# EAGLE design esp-dimmer (EAGLE 9.6.2)
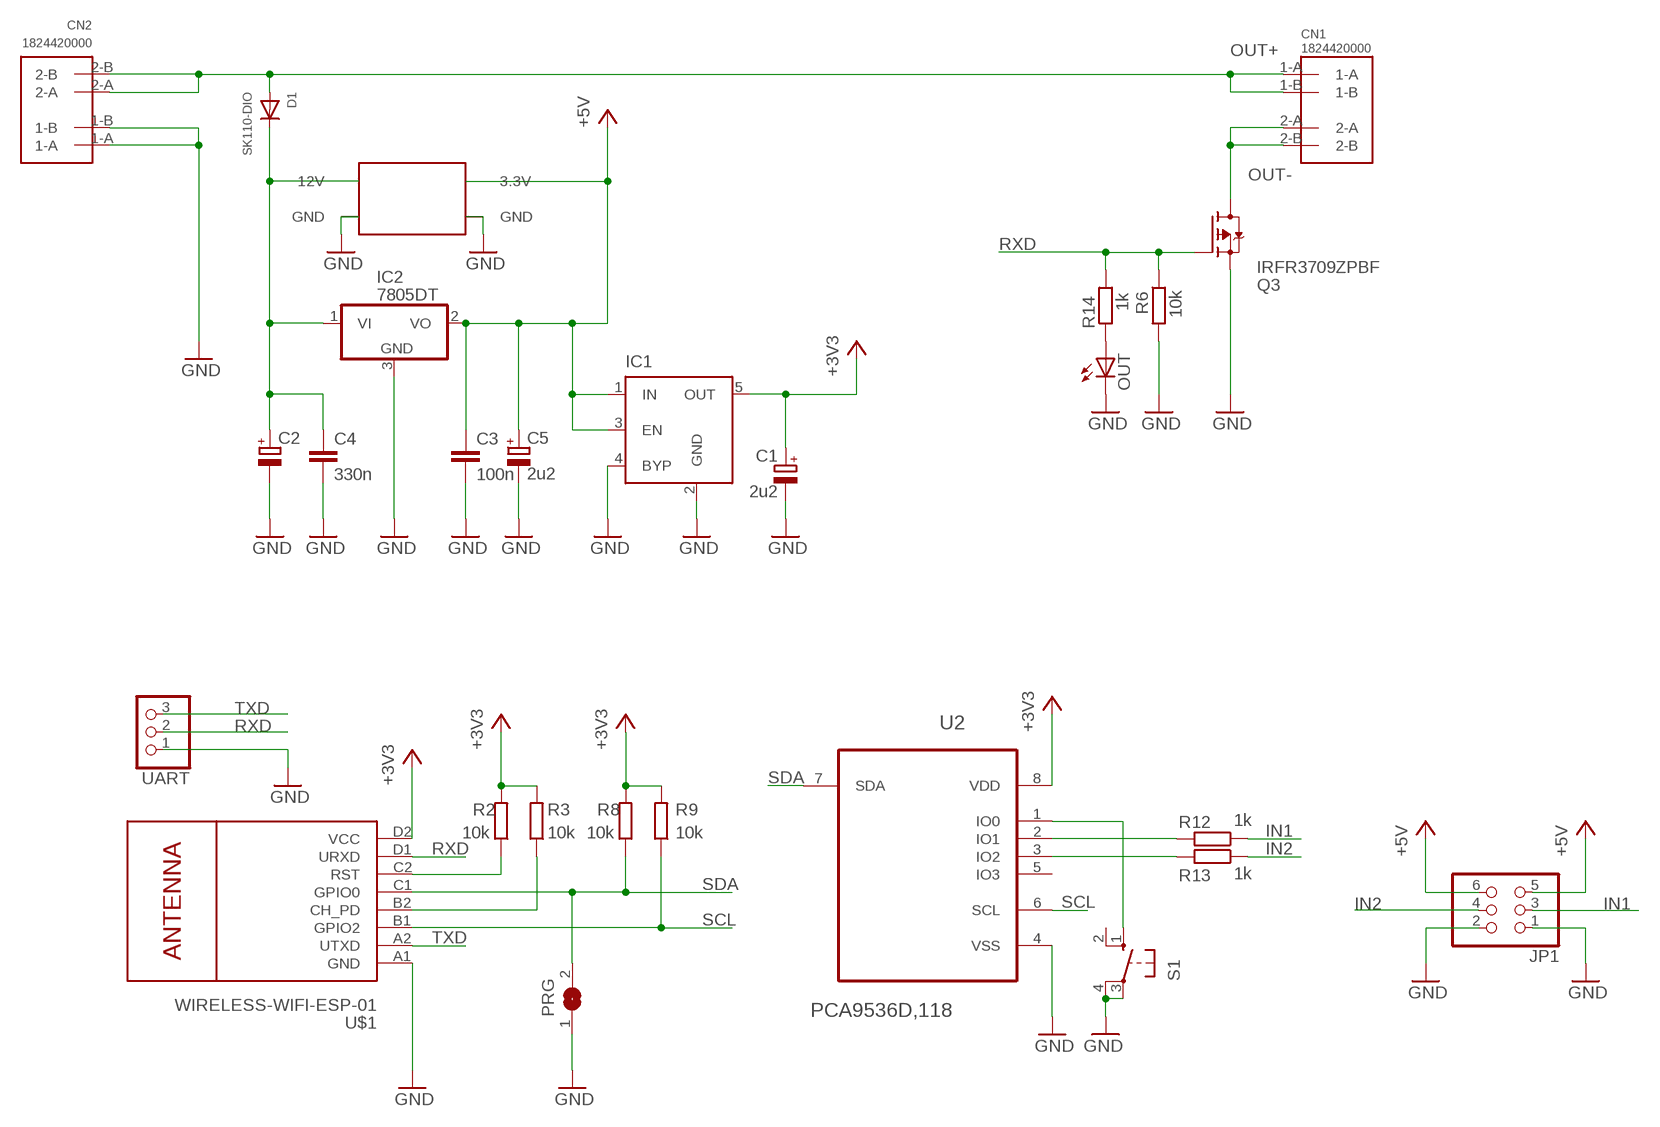
[diagram p0: schematic, sheet 1]

## Parts
C1  2u2  CPOL-EUSMCB  [SMC_B]
C2  CPOL-EUC/6032-28R  [C/6032-28R]
C3  100n  C-EUC0805  [C0805]
C4  330n  C-EUC0805  [C0805]
C5  2u2  CPOL-EUSMCB  [SMC_B]
CN1  1824420000  [1824420000]
CN2  1824420000  [1824420000]
D1  SK110-DIO  DIODESMA  [SMADIODE]
IC1  MIC5219XX  [SOT23-5]
IC2  7805DT  [TO252]
JP1  PINHD-2X3  [2X03]
OUT  LEDCHIPLED_0805  [CHIPLED_0805]
PRG  SJ  [SJ]
Q3  IRFR3709ZPBF  SPD30P06PTO252  [TO252]
R2  10k  R-EU_R0805  [R0805]
R3  10k  R-EU_R0805  [R0805]
R6  10k  R-EU_R0805  [R0805]
R8  10k  R-EU_R0805  [R0805]
R9  10k  R-EU_R0805  [R0805]
R12  1k  R-EU_R0805  [R0805]
R13  1k  R-EU_R0805  [R0805]
R14  1k  R-EU_R0805  [R0805]
S1  10-XX  [B3F-10XX]
U2  PCA9536D,118  [SOIC127P600X175-8N]
U$1  WIRELESS-WIFI-ESP-01  [WIRELESS-WIFI-ESP-01]
U$2  MP2307-MINI-360  [MP2307-MINI-360]
UART  PINHD-1X3  [1X03]

## Nets
+3V3: C1.+ IC1.5(OUT) R2.2 R3.2 R8.2 R9.2 U2.8(VDD) U$1.D2(VCC)
+5V: C3.1 C5.+ IC1.1(IN) IC1.3(EN) IC2.2(VO) JP1.5 JP1.6 U$2.3.3V
GND: C1.- C2.- C3.2 C4.2 C5.- CN2.1-A CN2.1-B IC1.2(GND) IC1.4(BYP) IC2.3(GND) JP1.1 JP1.2 OUT.C PRG.1 Q3.2(S) R6.2 S1.3(P) S1.4(P1) U2.4(VSS) U$1.A1(GND) U$2.GND@1(GND) U$2.GND@2(GND) UART.1
IN1: JP1.3 R12.1
IN2: JP1.4 R13.1
N$1: R3.1 U$1.B2(CH_PD)
N$2: R2.1 U$1.C2(RST)
N$3: S1.1(S) U2.1(IO0)
N$5: R13.2 U2.3(IO2)
N$6: R12.2 U2.2(IO1)
N$9: C2.+ C4.1 D1.C IC2.1(VI) U$2.12V
N$15: OUT.A R14.1
OUT+: CN1.1-A CN1.1-B CN2.2-A CN2.2-B D1.A
OUT-: CN1.2-A CN1.2-B Q3.3(D)
RXD: Q3.1(G) R6.1 R14.2 U$1.D1(URXD) UART.2
SCL: R9.1 U2.6(SCL) U$1.B1(GPIO2)
SDA: PRG.2 R8.1 U2.7(SDA) U$1.C1(GPIO0)
TXD: U$1.A2(UTXD) UART.3
Unconnected: S1.2(S1) U2.5(IO3)

## Library data of the parts
C1 C2 C5 = rcl:CPOL-EU: POLARIZED CAPACITOR, European symbol; SPICEPREFIX: C
C3 C4 = rcl:C-EU: CAPACITOR, European symbol; SPICEPREFIX: C
CN1 CN2 = 1824420000:1824420000: Check availability <https://pricing.snapeda.com/parts/1824420000/Weidmuller/view-part?ref=eda>; AVAILABILITY: In Stock; CHECK_PRICES: https://www.snapeda.com/parts/1824420000/Weidmuller/view-part/?ref=eda; DESCRIPTION: 2 Position Wire to Board Terminal Block Horizontal with Board 0.138 (3.50mm) Through Hole; MF: Weidmuller; MP: 1824420000; PACKAGE: None; PRICE: None; SNAPEDA_LINK: https://www.snapeda.com/parts/1824420000/Weidmuller/view-part/?ref=snap
D1 = adafruit:DIODE: Diode SMADIODE - SMA Surface Mount Package 20V 1A Schottky Diode Digikey: 641-1014-6-ND DO-1N4148 - Through Hole Small Current Diode SOD-123 20V 1 A (.5mV Vf) Schottky Diode - Digikey: MBRX120TPMSCT-ND SOD-323 10V 570mA (.38mV Vf, 3ns) Schottky Diode - Digikey: ZLLS410CT-ND SOD-523 30V 30mA Schottky Diode (RB751S-40TE61) - Digikey: RB751S-40TE61CT-ND SOT23-R/W - SOT23 Package (R = Solder Paste/Reflow Ovens, W = Hand-Soldering) BAT54Film 40V 300mA - Digikey: 497-7162-1-ND
IC1 = v-reg-micrel:MIC5219XX: VOLTAGE REGULATOR; OC_FARNELL: unknown; OC_NEWARK: unknown
IC2 = linear:78*: Positive VOLTAGE REGULATOR Source: http://cache.national.com/ds/LM/LM78L05.pdf http://www.fairchildsemi.com/ds/LM/LM7805.pdf
JP1 = pinhead:PINHD-2X3: PIN HEADER
OUT = adafruit:LED: LED OSRAM: - CHIPLED LG R971, LG N971, LY N971, LG Q971, LY Q971, LO R971, LY R971 LH N974, LH R974 LS Q976, LO Q976, LY Q976 LO Q996 - Hyper CHIPLED LW Q18S LB Q993, LB Q99A, LB R99A - SideLED LS A670, LO A670, LY A670, LG A670, LP A670 LB A673, LV A673, LT A673, LW A673 LH A674 LY A675 LS A676, LA A676, LO A676, LY A676, LW A676 LS A679, LY A679, LG A679 - Hyper Micro SIDELED® LS Y876, LA Y876, LO Y876, LY Y876 LT Y87S - SmartLED LW L88C, LW L88S LB L89C, LB L89S, LG L890 LS L89K, LO L89K, LY L89K LS L896, LA L896, LO L896, LY L896 - TOPLED LS T670, LO T670, LY T670, LG T670, LP T670 LSG T670, LSP T670, LSY T670, LOP T670, LYG T670 LG T671, LOG T671, LSG T671 LB T673, LV T673, LT T673, LW T673 LH T674 LS T676, LA T676, LO T676, LY T676, LB T676, LH T676, LSB T676, LW T676 LB T67C, LV T67C, LT T67C, LS T67K, LO T67K, LY T67K, LW E67C LS E67B, LA E67B, LO E67B, LY E67B, LB E67C, LV E67C, LT E67C LW T67C LS T679, LY T679, LG T679 LS T770, LO T770, LY T770, LG T770, LP T770 LB T773, LV T773, LT T773, LW T773 LH T774 LS E675, LA E675, LY E675, LS T675 LS T776, LA T776, LO T776, LY T776, LB T776 LHGB T686 LT T68C, LB T68C - Hyper Mini TOPLED® LB M676 - Mini TOPLED Santana® LG M470 LS M47K, LO M47K, LY M47K Source: http://www.osram.convergy.de/
PRG = jumper:SJ: SMD solder JUMPER
Q3 = transistor-fet:SPD30P06P: SIPMOS(R) Power-Transistor P-Channel, Enhancement mode Source: http://www.infineon.com/upload/Document/cmc_upload/documents/012/3615/SPD_U30P06P.pdf
R2 R3 R6 R8 R9 R12-R14 = rcl:R-EU_: RESISTOR, European symbol; SPICEPREFIX: R
S1 = switch-omron:10-XX: OMRON SWITCH; MPN: B3F-1000; OC_FARNELL: 176432; OC_NEWARK: 36M3542
U2 = PCA9536D_118:PCA9536D,118: 4-bit I2C-bus and SMBus I/O port Check availability <https://pricing.snapeda.com/parts/PCA9536D%2C118/NXP%20USA/view-part?ref=eda>; AVAILABILITY: In Stock; CHECK_PRICES: https://www.snapeda.com/parts/PCA9536D,118/NXP+USA+Inc./view-part/?ref=eda; DESCRIPTION: I/O Expander 4 I2C, SMBus 400 kHz 8-SO; MF: NXP USA; MP: PCA9536D,118; PACKAGE: SO-8 NXP Semiconductors; PRICE: None; PURCHASE-URL: https://www.snapeda.com/api/url_track_click_mouser/?unipart_id=556754&manufacturer=NXP USA&part_name=PCA9536D,118&search_term=None; SNAPEDA_LINK: https://www.snapeda.com/parts/PCA9536D,118/NXP+USA+Inc./view-part/?ref=snap
U$1 = diy-modules:WIRELESS-WIFI-ESP-01: Wireless Wi-Fi ESP-01 Module based on ESP8266 chip Click here to find device on ebay.com <http://www.ebay.com/sch/esp8266+esp+01+transceiver>
U$2 = MP2307-MINI-360:MP2307-MINI-360
UART = adafruit:PINHD-1X3: PIN HEADER

## Board
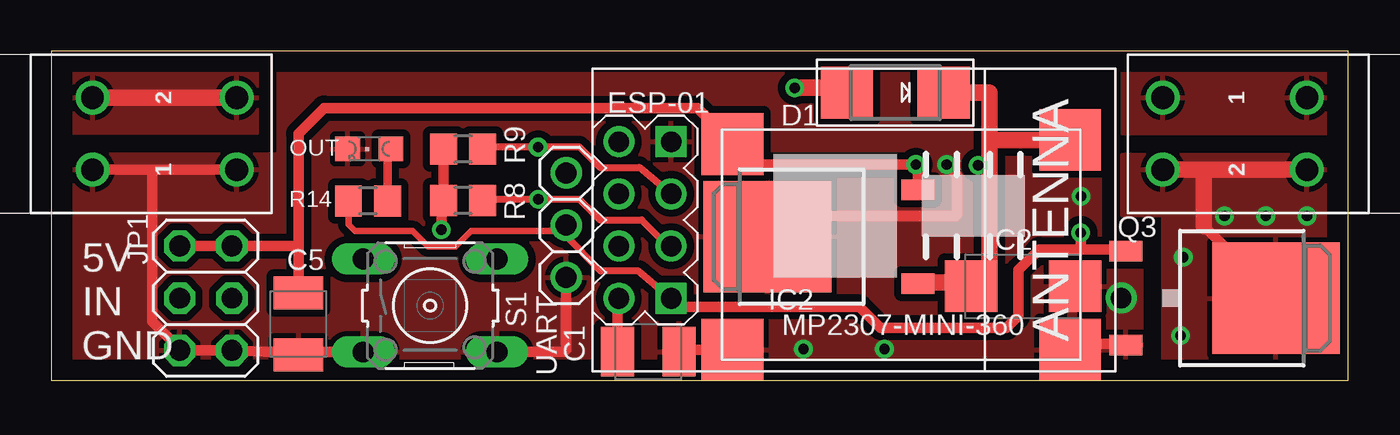
[diagram p1: board, top side]
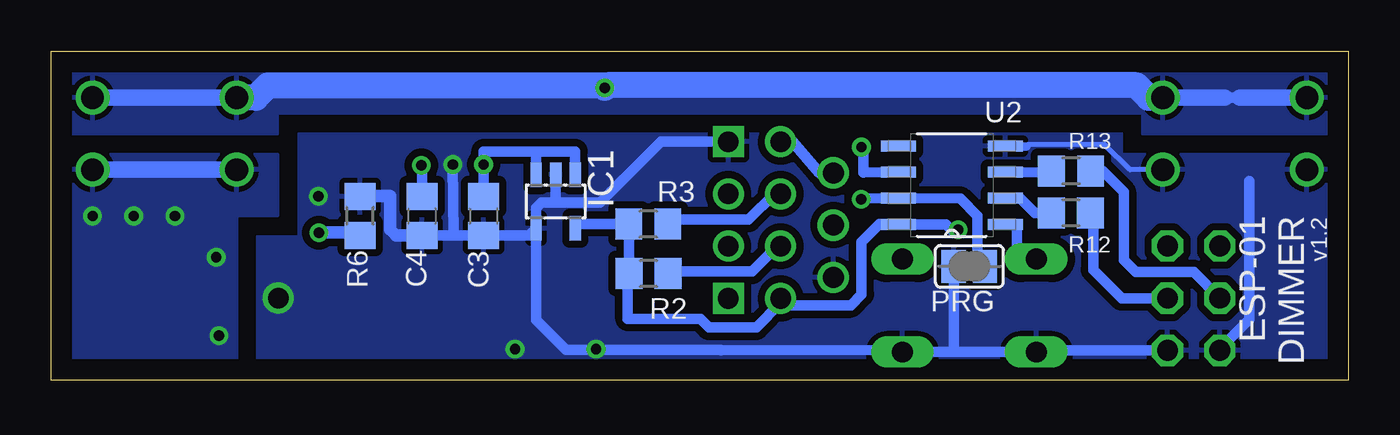
[diagram p2: board, bottom side, seen from below]

Size 63 x 16 mm. Coordinates in mm from the lower left corner, seen from the top.
Outline: 0,0 63,0 63,16 0,16 0,0
Copper layers (1*16): Top 0.035mm / dielectric 1.5mm / Bottom 0.035mm
Design rules "default *": minimum track width 6mil, minimum drill 0.35mm, track to track 14mil, track to pad 8mil, pad to pad 8mil, via to via 8mil, smd to smd 8mil, copper to edge 40mil, drill to drill 6mil, minimum pad ring 10mil, minimum via ring 8mil, stop-mask expansion 4mil, vias tented up to drill 0mil, thermal gap 10mil

### Footprints (pad centres in the part's own frame; a part is rotated, then mirrored left to right if it is on the bottom)
SMC_B = smd 1.6 x 2.4: + -1.5,0; - 1.5,0
C/6032-28R = smd 2.55 x 2.5: + 2.525,0; - -2.525,0
C0805 = smd 1.3 x 1.5: 1 -0.95,0; 2 0.95,0
1824420000 = drill 1.1: 1-A 1.75,3.5; 1-B 1.75,-3.5; 2-A -1.75,3.5; 2-B -1.75,-3.5
SMADIODE = smd 2.54 x 2.54: A 2.349,0; C -2.349,0
SOT23-5 = smd 0.55 x 1.2: 1 -0.95,-1.3; 2 0,-1.3; 3 0.95,-1.3; 4 0.95,1.3; 5 -0.95,1.3
TO252 = smd 1 x 1.6: 1 -2.28,-4.8; 2 2.28,-4.8 | smd 5.4 x 6.2: 3 0,2.5
2X03 = drill 1.016 octagon: 1 -2.54,-1.27; 2 -2.54,1.27; 3 0,-1.27; 4 0,1.27; 5 2.54,-1.27; 6 2.54,1.27
CHIPLED_0805 = smd 1.2 x 1.2: A 0,-1.05; C 0,1.05
SJ = smd 1.168 x 1.6: 1 -0.762,0; 2 0.762,0
R0805 = smd 1.3 x 1.5: 1 -0.95,0; 2 0.95,0
B3F-10XX = drill 1.016 long: 1 -3.251,2.261; 2 3.251,2.261; 3 -3.251,-2.261; 4 3.251,-2.261
SOIC127P600X175-8N = smd 1.702 x 0.533: 1 -2.591,1.905; 2 -2.591,0.635; 3 -2.591,-0.635; 4 -2.591,-1.905; 5 2.591,-1.905; 6 2.591,-0.635; 7 2.591,0.635; 8 2.591,1.905
WIRELESS-WIFI-ESP-01 = drill 1 square: A1 -8.89,3.81; D1 -8.89,-3.81 | drill 1: A2 -11.43,3.81; B1 -8.89,1.27; B2 -11.43,1.27; C1 -8.89,-1.27; C2 -11.43,-1.27; D2 -11.43,-3.81
MP2307-MINI-360 = smd 3 x 3: 3.3V 0.5,10.5; 12V 16.9,10.7; GND@1 16.9,0.5; GND@2 0.5,0.5
1X03 = drill 1.016: 1 -2.54,0; 2 0,0; 3 2.54,0

### Placement (x,y rotation side)
C1  29,1.4 0 top
C2  47.21,4.58 180 top
C3  42,8 270 bottom
C4  45,8 270 bottom
C5  12,2.75 270 top
CN1  57.5,12 90 top
CN2  5.5,12 270 top
D1  41,14 180 top
IC1  38.5,8.7 180 bottom
IC2  37.29,6.99 90 top
JP1  7.5,4 90 top
OUT  15.44,11.26 90 top
PRG  18.4,5.55 0 bottom
Q3  57,4 270 top
R2  33.99,5.2 180 bottom
R3  34,7.6 180 bottom
R6  48,8 90 bottom
R8  20,8.75 180 top
R9  20,11.25 180 top
R12  13.47,8.15 180 bottom
R13  13.46,10.19 180 bottom
R14  15.38,8.73 180 top
S1  18.4,3.64 0 top
U2  19.25,9.5 180 bottom
U$1  39,7.8 0 top
U$2  32.59,1 0 top
UART  25.01,7.55 90 top

### Tracks (layer width: path | path; a pad name or v marks a point on that pad's centre or on a via)
+3V3  (via drill 0.5)
  Top 0.508: R9.2 R8.2 18.95,8.65 v18.95,7.33 | C1.+ 27.5,3.72 U$1.D2
  Bottom 0.508: IC1.5 37.35,7.6 R3.2 34.95,7.01 34.94,7 R2.2 35,4.94 35,3 31.48,3 31.05,2.58 28.75,2.58 27.57,3.76 U$1.D2 27.24,3.66 24.16,3.66 23.63,4.19 23.63,6.74 22.77,7.6 U2.8 19.55,7.59 19.27,7.32 v18.96,7.32 v18.95,7.33
+5V  (via drill 0.5)
  Top 0.508: JP1.6 JP1.5 11.83,6.54 12,6.37 | 41.85,10.5 34,10.5 34,10.59 U$2.3.3V 33.09,11.54 31.38,13.25 13.25,13.25 12,12 12,6.37 | 41.85,10.5 v42,10.5 | IC2.2 42.09,10.26 41.85,10.5 | 12,6.37 C5.+
  Bottom 0.508: IC1.1 37.55,11.14 39.45,11.14 | 39.45,11.14 42,11.14 C3.1 v42,10.5 | IC1.3 39.45,11.14
GND  (via drill 0.5, 1)
  Top 0.508: Q3.2 52.14,1.78 50.07,1.78 | S1.3 12.64,1.38 | 12.64,1.38 10.35,1.38 JP1.1 JP1.2 6.31,1.46 4.89,2.88 4.89,10.25 CN2.1-A CN2.1-B | S1.4 24.89,1.38 25.01,1.5 UART.1 | C5.- 12.64,1.38 | IC2.3 34,7 35,8 43.95,8 44,8.05 44,10 v43.5,10.5 | C1.- 30.6,1.5 U$2.GND@2 33.5,1.5 33.73,1.27 34,1.27
  Bottom 0.254: CN2.1-A 10.6,10.25 11.83,11.48 15.54,11.48 15.64,11.38
  Bottom 0.406: U2.4 16.41,11.38 15.64,11.38
  Bottom 0.508: C4.2 43.49,7.05 | 43.49,7.05 C3.2 | C3.2 42,6.83 | JP1.1 15,1.46 15.08,1.38 19.23,1.38 | 19.23,1.38 S1.4 22,1.38 22.12,1.5 30.46,1.46 30.5,1.5 38,1.5 39.45,2.95 IC1.4 | 4.8,9.69 4.8,2.97 6.31,1.46 JP1.2 | 38.5,9 IC1.2 | IC1.4 39.45,8.39 39.19,8.65 36.35,8.65 33.39,11.61 U$1.A1 | C3.2 39.8,7.05 IC1.4 | v43.5,10.5 43.46,7.08 43.49,7.05 | PRG.1 19.16,1.45 19.23,1.38
  Bottom 0.61: R6.2 47.97,8.98 46.55,8.98 46.55,7.34 46.26,7.05 C4.2
  other vias: 51.98,4.01 40.47,1.53 36.54,1.52 50.03,8.96
  pour Top: 11,16 11,11.05 10.99,11.04 0,11.04 0,0 53,0 53,7 51,7 51,16
  pour Bottom: 11,12 51,12 51,7 53,7 53,0 0,0 0,11 11,11
IN1
  Bottom 0.508: R12.1 12.38,8.01 12.38,5.38 11,4 JP1.3
IN2
  Bottom 0.508: JP1.4 7.5,5.27 10.31,5.27 10.9,5.86 10.9,9.17 11.92,10.19 R13.1
N$1
  Bottom 0.508: U$1.B2 27.88,9.07 29.13,7.82 32.63,7.82 R3.1
N$2
  Bottom 0.508: U$1.C2 27.69,6.53 27.74,6.51 28.96,5.29 32.75,5.29 R2.1
N$3
  Bottom 0.508: U2.1 16.09,7.58 16.09,5.9 S1.1
N$5
  Bottom 0.508: U2.3 14.52,10.12 14.44,10.19 R13.2
N$6
  Bottom 0.508: U2.2 15.92,8.85 15.22,8.15 R12.2
N$9  (via drill 0.5)
  Top 0.508: v45.03,10.46 45.35,10.46 45.57,10.24 | U$2.12V 49,11.7
  Top 0.813: IC2.1 42.14,4.76 44.1,4.76 44.58,5.24 C2.+ 45.38,4.58 45.57,4.77 45.57,10.24 45.57,11 45.57,11.7 | D1.C 45.57,14 45.57,11.7 | 49,11.7 45.57,11.7
  Bottom 0.508: C4.1 45,10.43 v45.03,10.46
N$15
  Top 0.406: R14.1 16.33,11.1 OUT.A
OUT+  (via drill 0.5)
  Top 0.813: CN2.2-B 6,13.75 CN2.2-A | CN1.1-A 53.59,13.75 | D1.A 38.63,14.23 v36.11,14.23
  Bottom 0.508: 6,13.75 5.27,13.75 | v36.11,14.23 35.99,14.35
  Bottom 0.813: CN2.2-A 6,13.75 | 5.27,13.75 CN2.2-B | CN1.1-A CN1.1-B
  Bottom 1.27: CN2.2-A 9.69,13.75 10.29,14.35 35.99,14.35 | CN1.1-A 53.08,13.75 52.48,14.35 36.23,14.35 v36.11,14.23
  pour Top: 52,12 62,12 63,12 63,16 52,16
  pour Top: 0,12 0,16 10,16 10,12
  pour Bottom: 0,12 0,16 63,16 63,12 52,12 52,13 10,13 10,12
OUT-  (via drill 0.5)
  Top 0.508: Q3.3 56,7.5
  Top 0.813: CN1.2-A 56,10.25 | 56,10.25 CN1.2-B | 56,7.5 56,10.25
  Bottom 0.813: CN1.2-A CN1.2-B
  other vias: 59,8 61,8 57,8 54.86,2.18 55,6
  pour Top: 52,11 63,11 63,0 54,0 54,8 52,8
  pour Bottom: 63,0 63,11 54,11 52,11 52,8 54,8 54,0
RXD  (via drill 0.5)
  Top 0.305: 24.94,7.48 24.73,7.27 20.39,7.27 19.64,6.52 18.3,6.52 17.56,7.26 14.76,7.26 14.43,7.59 R14.2
  Top 0.35: U$1.D1 28.53,5.32 26.69,5.32 24.94,7.07 24.94,7.48
  Top 0.406: UART.2 24.94,7.48
  Top 0.508: 50.01,6.38 v50.01,7.18 | Q3.1 52.1,6.38 50.01,6.38 | 50.01,6.38 47.99,6.38 46.98,5.37 46.98,3.14 46.4,2.56 40.29,2.56 39.27,3.58 30.54,3.58 30.13,3.99 U$1.D1
  Bottom 0.61: v50.01,7.18 49.99,7.2 48.15,7.2 R6.1
SCL  (via drill 0.5)
  Top 0.35: U$1.B1 28.57,10.36 26.65,10.36 25.66,11.35 25.65,11.35 v23.64,11.35 21.05,11.35 R9.1
  Bottom 0.508: U2.6 23.55,10.12 23.55,11.35 v23.64,11.35
SDA  (via drill 0.5)
  Top 0.35: 21.14,8.81 v23.66,8.81 25.65,8.81 26.65,7.81 28.67,7.81 30.11,6.37 U$1.C1
  Top 0.508: R8.1 21.14,8.81
  Bottom 0.508: v23.66,8.81 23.66,8.85 U2.7 18.84,8.85 18,8 18,5.13 PRG.2
TXD
  Bottom 0.508: U$1.A2 27.01,11.61 25.69,10.09 UART.3

### Text on the board
tNames: ESP-01 | 5V / IN / GND
bNames: v1.2 | ESP-01 / DIMMER